# Altium schematic sheet Interface_MCU.SchDoc
size B; CompanyName: Rigado, LLC; Organization: Rigado, LLC; SheetNumber: 2; SheetTotal: X; SheetSize: B; SheetTitle: Interface MCU
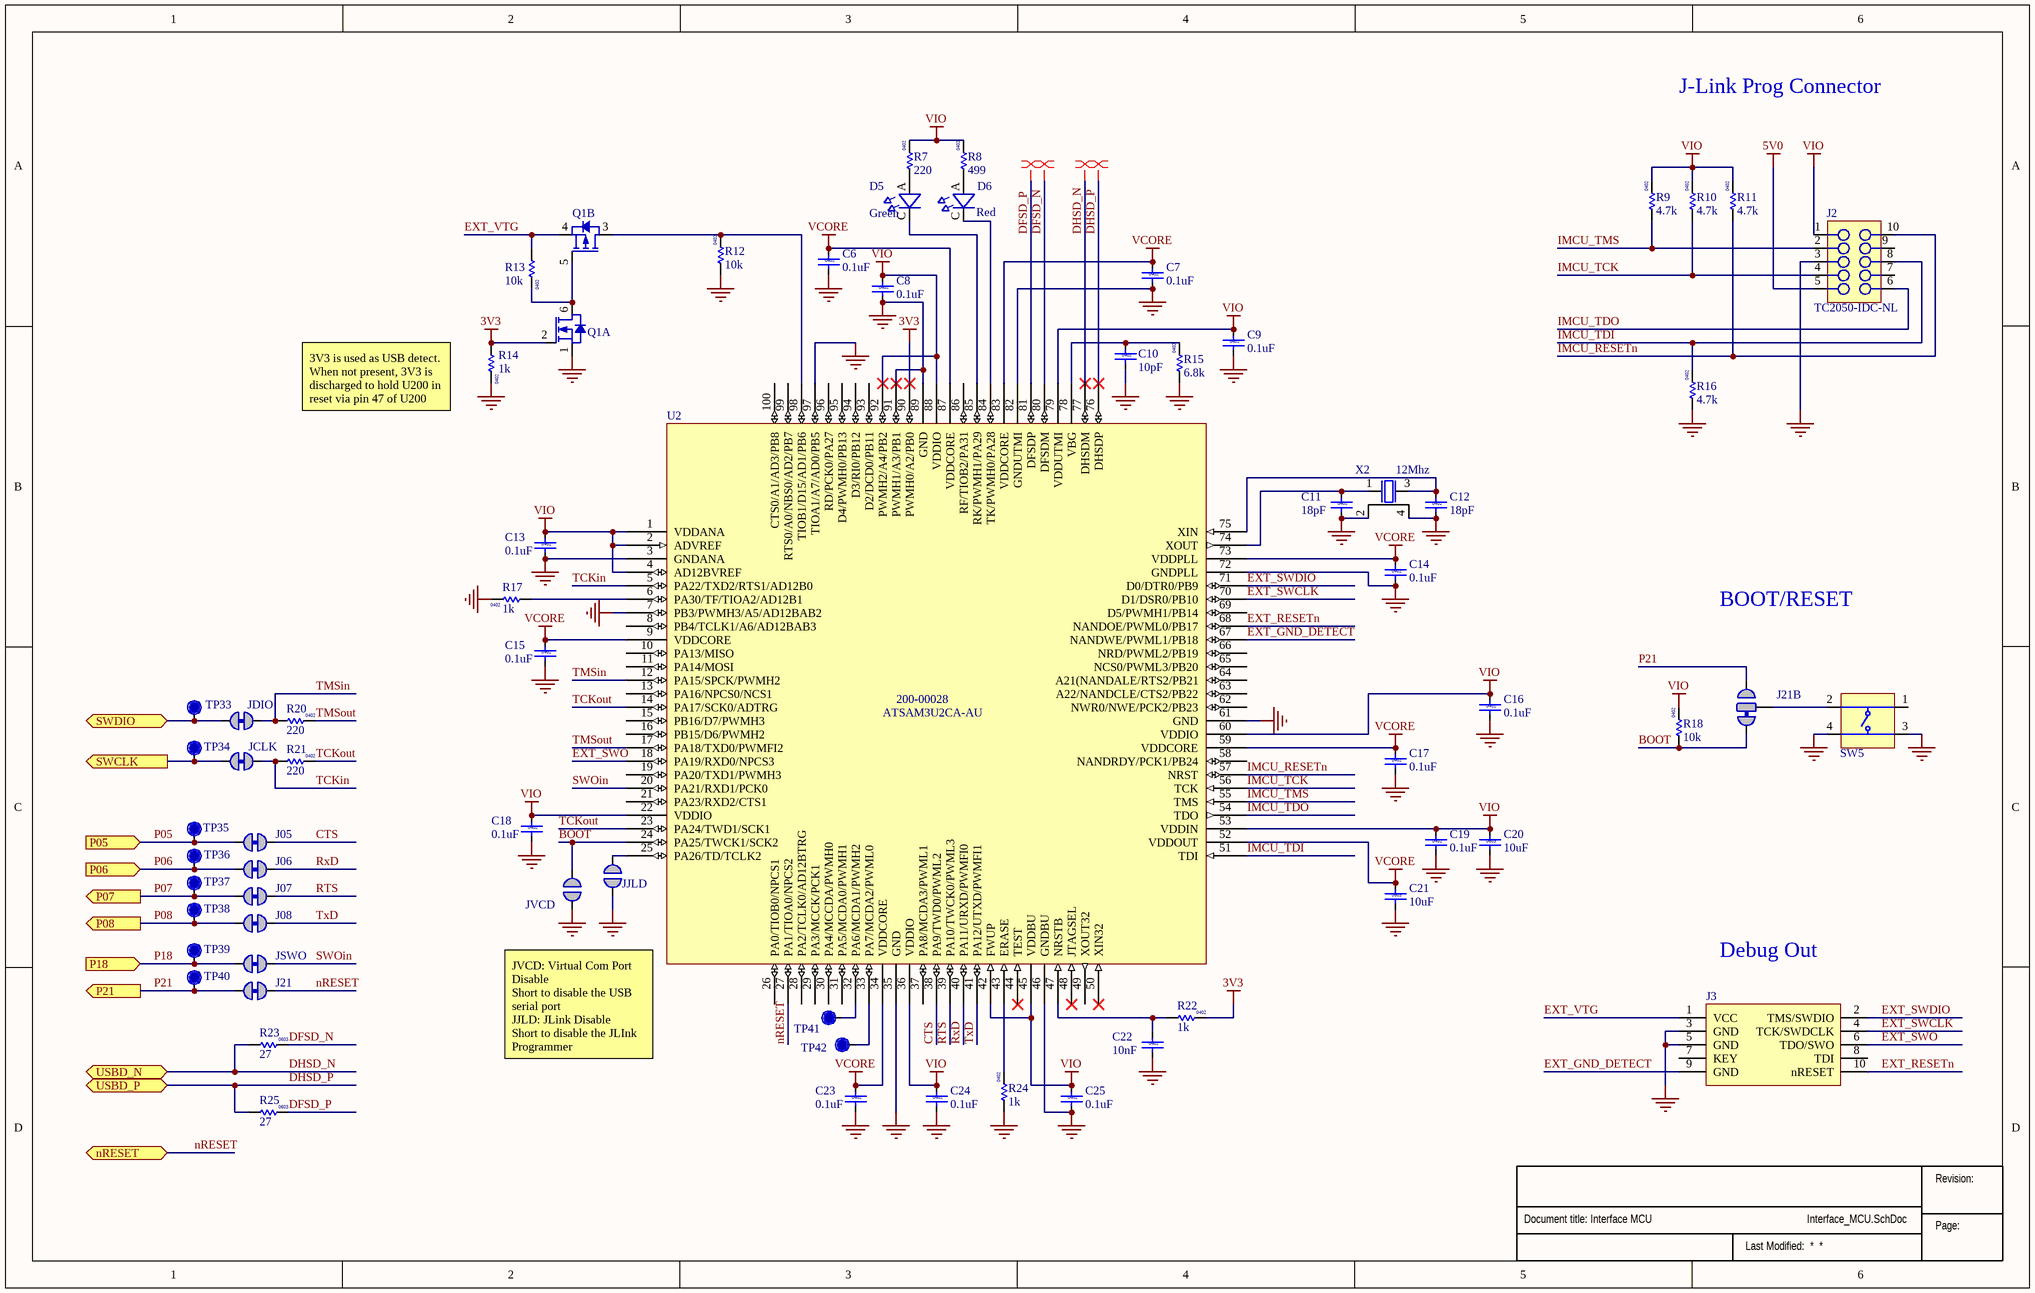
[diagram p0: Interface_MCU.SchDoc]

## Parts
?  (no value)  (graphical)
C6  value 0.1uF  Size: 0402  [Cap 0402 HD]  (hidden comment: 120-000160.1uF)
C7  value 0.1uF  Size: 0402  [Cap 0402 HD]  (hidden comment: 120-000160.1uF)
C8  value 0.1uF  Size: 0402  [Cap 0402 HD]  (hidden comment: 120-000160.1uF)
C9  value 0.1uF  Size: 0402  [Cap 0402 HD]  (hidden comment: 120-000160.1uF)
C10  value 10pF  Size: 0402  [Cap 0402]  (hidden comment: 120-0006510pF)
C11  value 18pF  Size: 0402  [Cap 0402 HD]  (hidden comment: 120-0004118pF)
C12  value 18pF  Size: 0402  [Cap 0402 HD]  (hidden comment: 120-0004118pF)
C13  value 0.1uF  Size: 0402  [Cap 0402 HD]  (hidden comment: 120-000160.1uF)
C14  value 0.1uF  Size: 0402  [Cap 0402 HD]  (hidden comment: 120-000160.1uF)
C15  value 0.1uF  Size: 0402  [Cap 0402 HD]  (hidden comment: 120-000160.1uF)
C16  value 0.1uF  Size: 0402  [Cap 0402 HD]  (hidden comment: 120-000160.1uF)
C17  value 0.1uF  Size: 0402  [Cap 0402 HD]  (hidden comment: 120-000160.1uF)
C18  value 0.1uF  Size: 0402  [Cap 0402 HD]  (hidden comment: 120-000160.1uF)
C19  value 0.1uF  Size: 0402  [Cap 0402 HD]  (hidden comment: 120-000160.1uF)
C20  value 10uF  Size: 0603  [Cap 0603 HD]  (hidden comment: 120-0002410uF)
C21  value 10uF  Size: 0603  [Cap 0603 HD]  (hidden comment: 120-0002410uF)
C22  value 10nF  Size: 0402  [Cap 0402 HD]  (hidden comment: 120-0008410nF)
C23  value 0.1uF  Size: 0402  [Cap 0402 HD]  (hidden comment: 120-000160.1uF)
C24  value 0.1uF  Size: 0402  [Cap 0402 HD]  (hidden comment: 120-000160.1uF)
C25  value 0.1uF  Size: 0402  [Cap 0402 HD]  (hidden comment: 120-000160.1uF)
D5  Color: Green  [Diode 0603 HD]  (hidden comment: 115-00019)
D6  Color: Red  [Diode 0603 HD]  (hidden comment: 115-00020)
J2  TC2050-IDC-NLDNP  [TC2050-IDC-NL]  (value not drawn)
J3  130-00099  [HDR.050P-10Pin-2x5-SMT_Key]  (value not drawn)
J05  Solderbridge-ShortDNP  [Solderbridge-Short]  (value not drawn)  (net tie, no BOM)
J06  Solderbridge-ShortDNP  [Solderbridge-Short]  (value not drawn)  (net tie, no BOM)
J07  Solderbridge-ShortDNP  [Solderbridge-Short]  (value not drawn)  (net tie, no BOM)
J08  Solderbridge-ShortDNP  [Solderbridge-Short]  (value not drawn)  (net tie, no BOM)
J21  Solderbridge-ShortDNP  [Solderbridge-Short]  (value not drawn)  (net tie, no BOM)
J21B  Solderbridge-OptionDNP  [Solderbridge-Option]  (value not drawn)  (net tie, no BOM)
JCLK  Solderbridge-ShortDNP  [Solderbridge-Short]  (value not drawn)  (net tie, no BOM)
JDIO  Solderbridge-ShortDNP  [Solderbridge-Short]  (value not drawn)  (net tie, no BOM)
JJLD  Solderbridge-OpenDNP  [Solderbridge-Open]  (value not drawn)  (no BOM)
JSWO  Solderbridge-ShortDNP  [Solderbridge-Short]  (value not drawn)  (net tie, no BOM)
JVCD  Solderbridge-OpenDNP  [Solderbridge-Open]  (value not drawn)  (no BOM)
Q1  140-00019  [SOT-963]  (value not drawn)  (parts A,B of 2)
R7  value 220  Size: 0402  [RES 0402 HD]  (hidden comment: 180-00098220)
R8  value 499  Size: 0402  [RES 0402 HD]  (hidden comment: 180-00031499)
R9  value 4.7k  Size: 0402  [RES 0402 HD]  (hidden comment: 180-001214.7k)
R10  value 4.7k  Size: 0402  [RES 0402 HD]  (hidden comment: 180-001214.7k)
R11  value 4.7k  Size: 0402  [RES 0402 HD]  (hidden comment: 180-001214.7k)
R12  value 10k  Size: 0402  [RES 0402 HD]  (hidden comment: 180-0002410k)
R13  value 10k  Size: 0402  [RES 0402 HD]  (hidden comment: 180-0002410k)
R14  value 1k  Size: 0402  [RES 0402 HD]  (hidden comment: 180-000211k)
R15  value 6.8k  Size: 0402  [RES 0402]  (hidden comment: 180-000686.8k)
R16  value 4.7k  Size: 0402  [RES 0402 HD]  (hidden comment: 180-001214.7k)
R17  value 1k  Size: 0402  [RES 0402 HD]  (hidden comment: 180-000211k)
R18  value 10k  Size: 0402  [RES 0402 HD]  (hidden comment: 180-0002410k)
R20  value 220  Size: 0402  [RES 0402 HD]  (hidden comment: 180-00056220)
R21  value 220  Size: 0402  [RES 0402 HD]  (hidden comment: 180-00056220)
R22  value 1k  Size: 0402  [RES 0402 HD]  (hidden comment: 180-000211k)
R23  value 27  Size: 0603  [RES 0603 HD]  (hidden comment: 180-0000627)
R24  value 1k  Size: 0402  [RES 0402 HD]  (hidden comment: 180-000211k)
R25  value 27  Size: 0603  [RES 0603 HD]  (hidden comment: 180-0000627)
SW5  135-00002  [SW_TACT_SMT_6mm]  (value not drawn)
TP33  TP  [TP10R]  (value not drawn)
TP34  TP  [TP10R]  (value not drawn)
TP35  TP  [TP10R]  (value not drawn)
TP36  TP  [TP10R]  (value not drawn)
TP37  TP  [TP10R]  (value not drawn)
TP38  TP  [TP10R]  (value not drawn)
TP39  TP  [TP10R]  (value not drawn)
TP40  TP  [TP10R]  (value not drawn)
TP41  TP  [TP10R]  (value not drawn)
TP42  TP  [TP10R]  (value not drawn)
U2  200-00028  Manufacturer P/N: ATSAM3U2CA-AU  [QFP0.5P25x25-100Pin]
X2  Frequency: 12Mhz  [XTAL_3225]  (hidden comment: 100-00013)

## Ports
nRESET (bidir), P05 (in), P06 (in), P07 (out), P08 (out), P18 (in), P21 (out), SWCLK (out), SWDIO (bidir), USBD_N (bidir), USBD_P (bidir)

## Nets
3V3: Q1.2(G1) R14.1 R22.2 U2.90(PWMH0/A2/PB0)
5V0: J2.5
GND: C6.2 C7.2 C8.2 C9.2 C10.2 C11.2 C12.2 C13.2 C14.2 C15.2 C16.2 C17.2 C18.2 C19.2 C20.2 C21.2 C22.2 C23.2 C24.2 C25.2 J2.3 J3.3(GND) J3.5(GND) JJLD.1 JVCD.1 Q1.1(S1) R12.1 R14.2 R15.1 R16.1 R17.2 R24.1 SW5.3(T3) SW5.4(T3) U2.3(GNDANA) U2.7(PB3/PWMH3/A5/AD12BAB2) U2.35(GND) U2.46(GNDBU) U2.61(GND) U2.72(GNDPLL) U2.82(GNDUTMI) U2.89(GND) U2.91(PWMH1/A3/PB1) U2.97(TIOA1/A7/AD0/PB5) X2.2 X2.4
VCORE: C6.1 C7.1 C14.1 C15.1 C17.1 C21.1 C23.1 U2.9(VDDCORE) U2.34(VDDCORE) U2.52(VDDOUT) U2.59(VDDCORE) U2.73(VDDPLL) U2.83(VDDCORE) U2.87(VDDCORE)
VIO: C8.1 C9.1 C13.1 C16.1 C18.1 C19.1 C20.1 C24.1 C25.1 J2.1 R7.2 R8.2 R9.2 R10.2 R11.2 R18.2 U2.1(VDDANA) U2.2(ADVREF) U2.4(AD12BVREF) U2.22(VDDIO) U2.36(VDDIO) U2.42(FWUP) U2.45(VDDBU) U2.53(VDDIN) U2.60(VDDIO) U2.79(VDDUTMI) U2.88(VDDIO) U2.92(PWMH2/A4/PB2)
BOOT: J21B.1 JVCD.2 R18.1 U2.24(PA25/TWCK1/SCK2)
CTS: J05.1 U2.38(PA9/TWD0/PWML2)
DFSD_N: R23.2 U2.80(DFSDM)
DFSD_P: R25.2 U2.81(DFSDP)
DHSD_N: R23.1 U2.77(DHSDM) ; port USBD_N
DHSD_P: R25.1 U2.76(DHSDP) ; port USBD_P
EXT_GND_DETECT: J3.9(GND) U2.67(NANDWE/PWML1/PB18)
EXT_RESETn: J3.10(nRESET) U2.68(NANDOE/PWML0/PB17)
EXT_SWCLK: J3.4(TCK/SWDCLK) U2.70(D1/DSR0/PB10)
EXT_SWDIO: J3.2(TMS/SWDIO) U2.71(D0/DTR0/PB9)
EXT_SWO: J3.6(TDO/SWO) U2.18(PA19/RXD0/NPCS3)
EXT_VTG: J3.1(VCC) Q1.4(S2) R13.1
IMCU_RESETn: J2.10 R11.1 U2.57(NRST)
IMCU_TCK: J2.4 R10.1 U2.56(TCK)
IMCU_TDI: J2.8 R16.2 U2.51(TDI)
IMCU_TDO: J2.6 U2.54(TDO)
IMCU_TMS: J2.2 R9.1 U2.55(TMS)
nRESET: J21.1 U2.27(PA1/TIOA0/NPCS2) ; port nRESET
P05: J05.2 TP35.1 ; port P05
P06: J06.2 TP36.1 ; port P06
P07: J07.2 TP37.1 ; port P07
P08: J08.2 TP38.1 ; port P08
P18: JSWO.2 TP39.1 ; port P18
P21: J21.2 J21B.3 TP40.1 ; port P21
RTS: J07.1 U2.39(PA10/TWCK0/PWML3)
RxD: J06.1 U2.40(PA11/URXD/PWMFI0)
SWCLK: JCLK.2 TP34.1 ; port SWCLK
SWDIO: JDIO.2 TP33.1 ; port SWDIO
SWOin: JSWO.1 U2.20(PA21/RXD1/PCK0)
TCKin: JCLK.1 R21.1 U2.5(PA22/TXD2/RTS1/AD12B0)
TCKout: R21.2 U2.14(PA17/SCK0/ADTRG) U2.23(PA24/TWD1/SCK1)
TMSin: JDIO.1 R20.1 U2.12(PA15/SPCK/PWMH2)
TMSout: R20.2 U2.17(PA18/TXD0/PWMFI2)
TxD: J08.1 U2.41(PA12/UTXD/PWMFI1)
NetC10_1: C10.1 R15.2 U2.78(VBG)
NetC11_1: C11.1 U2.74(XOUT) X2.1
NetC12_1: C12.1 U2.75(XIN) X2.3
NetC22_1: C22.1 R22.1 U2.47(NRSTB)
NetD5_A: D5.A(Anode) R7.1
NetD5_C: D5.C(Cathode) U2.85(RK/PWMH1/PA29)
NetD6_A: D6.A(Anode) R8.1
NetD6_C: D6.C(Cathode) U2.84(TK/PWMH0/PA28)
NetJ21B_2: J21B.2 SW5.2(T2)
NetJJLD_2: JJLD.2 U2.25(PA26/TD/TCLK2)
NetQ1_3: Q1.3(D2) R12.2 U2.98(TIOB1/D15/AD1/PB6)
NetQ1_5: Q1.5(G2) Q1.6(D1) R13.2
NetR17_1: R17.1 U2.6(PA30/TF/TIOA2/AD12B1)
NetR24_2: R24.2 U2.43(ERASE)
NetTP41_1: TP41.1 U2.32(PA6/MCDA1/PWMH2)
NetTP42_1: TP42.1 U2.33(PA7/MCDA2/PWML0)

Not connected (* = marked no-connect by the designer): J2 7 9; J3 7(KEY) 8(TDI); SW5 1(T1); U2 8(PB4/TCLK1/A6/AD12BAB3) 10(PA13/MISO) 11(PA14/MOSI) 13(PA16/NPCS0/NCS1) 15(PB16/D7/PWMH3) 16(PB15/D6/PWMH2) 19(PA20/TXD1/PWMH3) 21(PA23/RXD2/CTS1) 26(PA0/TIOB0/NPCS1) 28(PA2/TCLK0/AD12BTRG) 29(PA3/MCCK/PCK1) 30(PA4/MCCDA/PWMH0) 31(PA5/MCDA0/PWMH1) 37(PA8/MCDA3/PWML1) 44(TEST)* 48(JTAGSEL)* 49(XOUT32) 50(XIN32)* 58(NANDRDY/PCK1/PB24) 62(NWR0/NWE/PCK2/PB23) 63(A22/NANDCLE/CTS2/PB22) 64(A21(NANDALE/RTS2/PB21) 65(NCS0/PWML3/PB20) 66(NRD/PWML2/PB19) 69(D5/PWMH1/PB14) 86(RF/TIOB2/PA31) 93(D2/DCD0/PB11) 94(D3/RI0/PB12) 95(D4/PWMH0/PB13) 96(RD/PCK0/PA27) 99(RTS0/A0/NBS0/AD2/PB7) 100(CTS0/A1/AD3/PB8)

## Layout directives
differential pair: DFSD_N, DFSD_P, DHSD_N, DHSD_P

## Notes on the sheet
- J-Link Prog Connector
- (near R14) 3V3 is used as USB detect. When not present, 3V3 is discharged to hold U200 in reset via pin 47 of U200
- BOOT/RESET
- Debug Out
- (near U2) JVCD: Virtual Com Port Disable
  Short to disable the USB serial port
  JJLD: JLink Disable
  Short to disable the JLInk Programmer
- Revision:
- Page:

## Library data of the parts
? = Sub_Title_Block: Minimized schematic title block for all subset sheets
C6-C9 C13-C19 C23-C25 = 120-00016: Cap, Ceramic 0.1uF 10V 10% X5R 0402; Part Name: CAP CER 0.1UF 10V 10% X5R 0402; Part_Type: Ceramic Capacitor; Manufacturer: Murata Electronics North America; Manufacturer P/N: GRM155R61A104KA01J; Item_Phase: Production; Component Mounting Type: SMT; Tolerance: +/- 10%; Use in new designs: Yes; Part Number: 120-00016; Revision: 0A; Supplier 1: Digi-Key; Supplier Part Number 1: 490-6297-1-ND; Manufacturer 2: Yageo; Manufacturer P/N 2: CC0402KRX5R6BB104; Supplier 2: Digi-Key; Supplier Part Number 2: 311-1336-1-ND; Arena Link: https://app.bom.com/a/GYHPV2L2L43KRMBK?v=spec.summary; Height: 0.55mm; Pins: 2; Temperature Coefficient: X5R; Voltage: 10V
C10 = 120-00065: Cap, Ceramic, 10pF 50V 5% NPO 0402; Part Name: CAP CER 10PF 50V 5% NP0 0402; Part_Type: Ceramic Capacitor; Manufacturer: Murata Electronics North America; Manufacturer P/N: GRM1555C1H100JA01D; Item_Phase: Preliminary; Component Mounting Type: SMT; Temperature Coefficient: NP0; Tolerance: +/- 5%; Use in new designs: Yes; Part Number: 120-00065; Supplier 1: Digi-Key; Supplier Part Number 1: 490-5921-1-ND; Arena Link: https://app.bom.com/a/DVEMSZIZI10GXRGL?v=spec.summary; Height: 0.55mm; Pins: 2; Voltage: 50V
C11 C12 = 120-00041: Cap, Ceramic 18pF 50V 5% NP0 0402; Part Name: CAP CER 18PF 50V 5% NP0 0402; Part_Type: Ceramic Capacitor; Manufacturer: Murata Electronics North America; Manufacturer P/N: GRM1555C1H180JA01D; Item_Phase: Production; Component Mounting Type: SMT; Tolerance: +/- 5%; Use in new designs: Yes; Part Number: 120-00041; Revision: 0B; Supplier 1: Digi-Key; Supplier Part Number 1: 490-5858-1-ND; Manufacturer 2: Samsung Electro-Mechanics America, Inc; Manufacturer P/N 2: CL05C180JB5NNNC; Supplier 2: Digi-Key; Supplier Part Number 2: 1276-1140-1-ND; Arena Link: https://app.bom.com/a/P7QY4BUBUDCTKHGO?v=spec.summary; Height: 0.55mm; Pins: 2; Temperature Coefficient: NP0; Voltage: 50V
C20 C21 = 120-00024: Cap, Ceramic 10uF 10V 20% X5R 0603; Part Name: CAP CER 10UF 10V 20% X5R 0603; Part_Type: Ceramic Capacitor; Manufacturer: Murata Electronics North America; Manufacturer P/N: GRM188R61A106ME69D; Item_Phase: Preliminary; Component Mounting Type: SMT; Tolerance: +/- 20%; Use in new designs: Yes; Part Number: 120-00024; Supplier 1: Digi-Key; Supplier Part Number 1: 490-10475-1-ND; Arena Link: https://app.bom.com/a/L3MU07Q7Q98PUPRN?v=spec.summary; Height: 0.9mm; Pins: 2; Temperature Coefficient: X5R; Voltage: 10V
C22 = 120-00084: CL05B103KO5NNNC; Part Name: CAP CER 10nF 16V 10% X7R 0402; Part_Type: Ceramic Capacitor; Manufacturer: Samsung Electro-Mechanics America, Inc; Item_Phase: Preliminary; Component Mounting Type: SMT; Temperature Coefficient: X7R; Tolerance: +/- 10%; Use in new designs: Yes; Voltage: 16V; Part Number: 120-00084; Manufacturer P/N: CL05B103KO5NNNC; Supplier 1: Digi-Key; Supplier Part Number 1: 1276-1051-1-ND; Arena Link: https://app.bom.com/a/9RAIOVEVEXWCKA3H?v=spec.summary; Pins: 2
D5 = 115-00019: LED GREEN CLEAR 0603 SMD; Manufacturer: Lite-On Inc; Manufacturer P/N: LTST-C190KGKT; Item_Phase: Preliminary; Body Size: 1.60mm x 0.80mm; Component Mounting Type: SMT; Current: 20mA; Use in new designs: Yes; Vf: 2V; Part Number: 115-00019; Part Name: LED GREEN CLEAR 0603 SMD; Part_Type: LED; Supplier 1: Digi-Key; Supplier Part Number 1: 160-1435-1-ND; Arena Link: https://app.bom.com/a/9RAIOVEVEXWBVX8A?v=spec.summary; Height: 0.8mm; Mounting Type: Surface Mount; Size: 0603; Pins: 2
D6 = 115-00020: LED RED CLEAR 0603 SMD; Manufacturer: Lite-On Inc; Manufacturer P/N: LTST-C191KRKT; Item_Phase: Preliminary; Body Size: 1.60mm x 0.80mm; Component Mounting Type: SMT; Current: 20mA; MFG Package: 0603; Number of Circuits: 1; Use in new designs: Yes; Vf: 2V; Part Number: 115-00020; Part Name: LED RED CLEAR 0603 SMD; Part_Type: LED; Supplier 1: Digi-Key; Supplier Part Number 1: 160-1447-1-ND; Arena Link: https://app.bom.com/a/J1KSY5O5O76K0HBF?v=spec.summary; Height: 0.55mm; Mounting Type: Surface Mount; Size: 0603; Pins: 2
J2 = TC2050-IDC-NL: CON PADS FOR CBL PLUG-OF-NAILS 10-PIN NO LEGS; Manufacturer: TAG Connect; Added By: Paul B; Manufacturer P/N: TC2050-IDC-NL; Part Number: TC2050-IDC-NL; Size: 6.1mm x 9.9mm; Height: 0; DNP: DNP; Added Date: 12/3/2015
J3 = 130-00099: Header 0.05" 10Pin 2Row SMD Black; Part Name: CON HDR 0.05" 10Pin 2Row SMD Black; Part_Type: Connector; Manufacturer: Samtec; Manufacturer P/N: FTSH-105-01-F-DV-K; Item_Phase: Pre-Production; Component Mounting Type: SMT; Keyed: Yes; Locking: No; Pin Pitch: 0.050"; Rows: 2; Part Number: 130-00099; Revision: 1; Supplier 1: Digi-Key; Supplier Part Number 1: SAM8796-ND; Arena Link: https://app.bom.com/a/5N6EKRARATS7TSHL?v=spec.summary; Color: Black; Connector Type: Header; Height: 6mm; Length: 12.75mm; Pins: 10; Use in new designs: Yes; Width: 4.78
J05 J06 J07 J08 J21 JCLK JDIO JSWO = Solderbridge-Short: Added By: Paul B; Part Number: Solderbridge-Short; Height: 0; DNP: DNP; Added Date: 12/2/2015
J21B = Solderbridge-Option: Added By: Paul B; Part Number: Solderbridge-Option; Height: 0; DNP: DNP; Added Date: 12/3/2015
JJLD JVCD = Solderbridge-Open: Added By: Paul B; Part Number: Solderbridge-Open; Height: 0; DNP: DNP; Added Date: 12/2/2015
Q1 = 140-00019: Mosfet, Dual, N-Channel and P-Channel Pair, 20V 180mA, SOT963; Part Name: MOSFET N/P-CH 20V 180mA SOT963; Manufacturer: Diodes Incorporated; Manufacturer P/N: DMC2990UDJ-7; Item_Phase: Preliminary; Body Size: 1mm x 0.8mm; Component Mounting Type: SMT; Current: 300mA, 180mA; Transistor Type: Multiple; Use in new designs: Yes; VGS Threshold: 1.0V, -1.0V; Voltage: 20V, -20V; Part Number: 140-00019; Part_Type: MOSFET; Supplier 1: Digi-Key; Supplier Part Number 1: DMC2990UDJ-7DITR-ND; Arena Link: https://app.bom.com/a/P7QY4BUBUDCRSOL7?v=spec.summary; Height: 0.5mm; MFG Package: SOT-963; Package Type: SOT; Pins: 6
R7 = 180-00098: RC1005J221CS; Part Name: RES SMD 220 OHM 5% 1/16W 0402; Part_Type: Resistor; Manufacturer: Samsung Electro-Mechanics America, Inc; Item_Phase: Preliminary; Component Mounting Type: SMT; Power: 1/16W; Tolerance: +/- 5%; Use in new designs: Yes; Part Number: 180-00098; Manufacturer P/N: RC1005J221CS; Supplier 1: Digi-Key; Supplier Part Number 1: 1276-4360-1-ND; Arena Link: https://app.bom.com/a/8Q9HNUDUDWVBJC30?v=spec.summary; Pins: 2
R8 = 180-00031: Resistor 499 ohm 1%, 1/16W, 0402; Part Name: RES SMD 499 OHM 1% 1/16W 0402; Manufacturer: Rohm Semiconductor; Manufacturer P/N: MCR01MRTF4990; Item_Phase: Preliminary; Component Mounting Type: SMT; Tolerance: +/- 1%; Use in new designs: Yes; Part Number: 180-00031; Part_Type: Resistor; Supplier 1: Digi-Key; Supplier Part Number 1: RHM499CDCT-ND; Manufacturer 2: Samsung Electro-Mechanics America, Inc; Manufacturer P/N 2: RC1005F4990CS; Arena Link: https://app.bom.com/a/Q8RZ5CVCVEDU1SS5?v=spec.summary; Height: 0.4mm; Pins: 2; Power: 1/16W
R9-R11 R16 = 180-00121: RES SMD 4.7K OHM 1% 1/16W 0402; Part_Type: Resistor; Manufacturer: Samsung Electro-Mechanics America, Inc; Manufacturer P/N: RC1005F472CS; Item_Phase: Preliminary; Component Mounting Type: SMT; Tolerance: +/- 1%; Use in new designs: Yes; Part Number: 180-00121; Part Name: RES SMD 4.7K OHM 1% 1/16W 0402; Supplier 1: Digi-Key; Supplier Part Number 1: 1276-3466-1-ND; Arena Link: https://app.bom.com/a/J1KSY5O5O76K0HVP?v=spec.summary; Height: 0.4mm; Pins: 2; Power: 1/16W
R12 R13 R18 = 180-00024: Resistor 10k ohm 1% 1/16W, 0402; Part Name: RES SMD 10K OHM 1% 1/16W 0402; Manufacturer: Rohm Semiconductor; Manufacturer P/N: MCR01MRTF1002; Item_Phase: Production; Component Mounting Type: SMT; Tolerance: +/- 1%; Use in new designs: Yes; Part Number: 180-00024; Part_Type: Resistor; Revision: 0A; Supplier 1: Digi-Key; Supplier Part Number 1: RHM10.0KCDCT-ND; Manufacturer 2: Samsung Electro-Mechanics America, Inc; Manufacturer P/N 2: RC1005F103CS; Arena Link: https://app.bom.com/a/0I19FM5M5ON4B4RQ?v=spec.summary; Height: 0.4mm; Pins: 2; Power: 1/16W; Voltage: N/A
R14 R17 R22 R24 = 180-00021: Resistor 1k ohm 1% 1/16W, 0402; Part Name: RES SMD 1K OHM 1% 1/16W 0402; Manufacturer: Rohm Semiconductor; Manufacturer P/N: MCR01MRTF1001; Item_Phase: Production; Component Mounting Type: SMT; Tolerance: +/- 1%; Use in new designs: Yes; Part Number: 180-00021; Part_Type: Resistor; Revision: 0A; Supplier 1: Digi-Key; Supplier Part Number 1: RHM1.00KCDCT-ND; Manufacturer 2: Samsung Electro-Mechanics America, Inc; Manufacturer P/N 2: RC1005F102CS; Supplier 2: Digi-Key; Supplier Part Number 2: 1276-3430-1-ND; Arena Link: https://app.bom.com/a/GYHPV2L2L43KRMAJ?v=spec.summary; Height: 0.4mm; Pins: 2; Power: 1/16W
R15 = 180-00068: Resistor 6.8k ohm 1%, 1/16W, 0402; Part Name: RES SMD 6.8K OHM 1% 1/16W 0402; Manufacturer: Rohm Semiconductor; Manufacturer P/N: MCR01MRTF6801; Item_Phase: Preliminary; Component Mounting Type: SMT; Tolerance: +/- 1%; Use in new designs: Yes; Part Number: 180-00068; Part_Type: Resistor; Supplier 1: Digi-Key; Supplier Part Number 1: RHM6.8KCDCT-ND; Manufacturer 2: Samsung Electro-Mechanics America, Inc; Manufacturer P/N 2: RC1005F682CS; Supplier 2: Digi-Key; Supplier Part Number 2: 1276-4098-1-ND; Arena Link: https://app.bom.com/a/0I19FM5M5ON4VS3G?v=spec.summary; Height: 0.4mm; Pins: 2; Power: 1/16W
R20 R21 = 180-00056: Resistor 220 ohm 1%, 1/16W, 0402; Part Name: RES SMD 220 OHM 1% 1/16W 0402; Manufacturer: Panasonic Electronic Components; Manufacturer P/N: ERJ-2RKF2200X; Item_Phase: Preliminary; Component Mounting Type: SMT; Tolerance: +/- 1%; Use in new designs: Yes; Part Number: 180-00056; Part_Type: Resistor; Supplier 1: Digi-Key; Supplier Part Number 1: P220LCT-ND; Manufacturer 2: Rohm Semiconductor; Manufacturer P/N 2: MCR01MRTF2200; Supplier 2: Digi-Key; Supplier Part Number 2: RHM220CDCT-ND; Arena Link: https://app.bom.com/a/1J2AGN6N6PO5WUJN?v=spec.summary; Height: 0.4mm; Pins: 2; Power: 1/16W
R23 R25 = 180-00006: Resistor 27 ohm 5%, 1/10W, 0603; Part Name: RES SMD 27 OHM 5% 1/10W 0603; Manufacturer: Rohm Semiconductor; Manufacturer P/N: MCR03ERTJ270; Item_Phase: Production; Component Mounting Type: SMT; Tolerance: +/- 5%; Use in new designs: Yes; Part Number: 180-00006; Part_Type: Resistor; Revision: 0A; Supplier 1: Digi-Key; Supplier Part Number 1: RHM27CGCT-ND; Manufacturer 2: Samsung Electro-Mechanics America, Inc; Manufacturer P/N 2: RC1608J270CS; Supplier 2: Digi-Key; Supplier Part Number 2: 1276-5024-1-ND; Arena Link: https://app.bom.com/a/1J2AGN6N6PO6OYQS?v=spec.summary; Height: 0.55mm; Pins: 2; Power: 1/10W; Voltage: N/A
SW5 = 135-00002: Tactile Switch, SPST-NO, SMT 160gf.; Part Name: Button Tactile SPST-NO 50mA 6mm SMT; Part_Type: Button; Manufacturer: C&K Components; Manufacturer P/N: PTS645SM43SMTR92 LFS; Item_Phase: Preliminary; Body Size: 6mm x 6mm; Current: 50mA; Switch/Button Circuit: SPST; Switch/Button Function: Off-Mom; Use in new designs: Yes; Voltage: 12VDC; Part Number: 135-00002; Supplier 1: Digi-Key; Supplier Part Number 1: CKN9112CT-ND; Arena Link: https://app.bom.com/a/L3MU07Q7Q98QQQW6?v=spec.summary; Component Mounting Type: SMT; Height: 4.3mm; Pins: 4
TP33-TP42 = TP10R: Testpoint, Round 1.0mm Dia; Added By: Jeremy D; Part Number: TP10R; Size: 1.0mm; Height: 0; DNP: DNP; Added Date: 2/1/2015; Checked By: Paul B; Checked Date: 2/5/2015
U2 = 200-00028: IC MCU 32BIT 128KB FLASH 100LQFP; Part_Type: Microcontroller; Manufacturer: Atmel; Item_Phase: Preliminary; Body Size: 14mm x 14mm; Component Mounting Type: SMT; Core Architecture: Cortex M3; MFG Package: 100-LQFP; RAM Size: 36kB; SMT Pitch: 0.5mm; Use in new designs: Yes; Voltage: 3.6V; Part Number: 200-00028; Part Name: ATSAM3U2CA-AU; Supplier 1: Digi-Key; Supplier Part Number 1: ATSAM3U2CA-AU-ND; Arena Link: https://app.bom.com/a/XFY6CJ2J2LKZL4IA?v=spec.summary; Core Bits: 32 Bit; Flash Size: 128kB; Height: 1.6mm; Package Type: QFP; Pins: 100
X2 = 100-00013: 7M-12.000MAAJ-T; Part Name: XTAL 12MHz 18pF 30ppm 3225; Part_Type: Crystal/Oscillator; Manufacturer: TXC CORPORATION; Item_Phase: Preliminary; Body Size: 3.2mm x 2.5mm; CL: 18pF; Component Mounting Type: SMT; Frequency Tolerance: 30ppm; MFG Package: 4-SMD; Use in new designs: Yes; Part Number: 100-00013; Manufacturer P/N: 7M-12.000MAAJ-T; Supplier 1: Digi-Key; Supplier Part Number 1: 887-1121-1-ND; Arena Link: https://app.bom.com/a/EWFNT0J0J21HKWWY?v=spec.summary; Height: 0.7mm; Pins: 4